# Altium schematic sheet adc ext.SchDoc
size A4
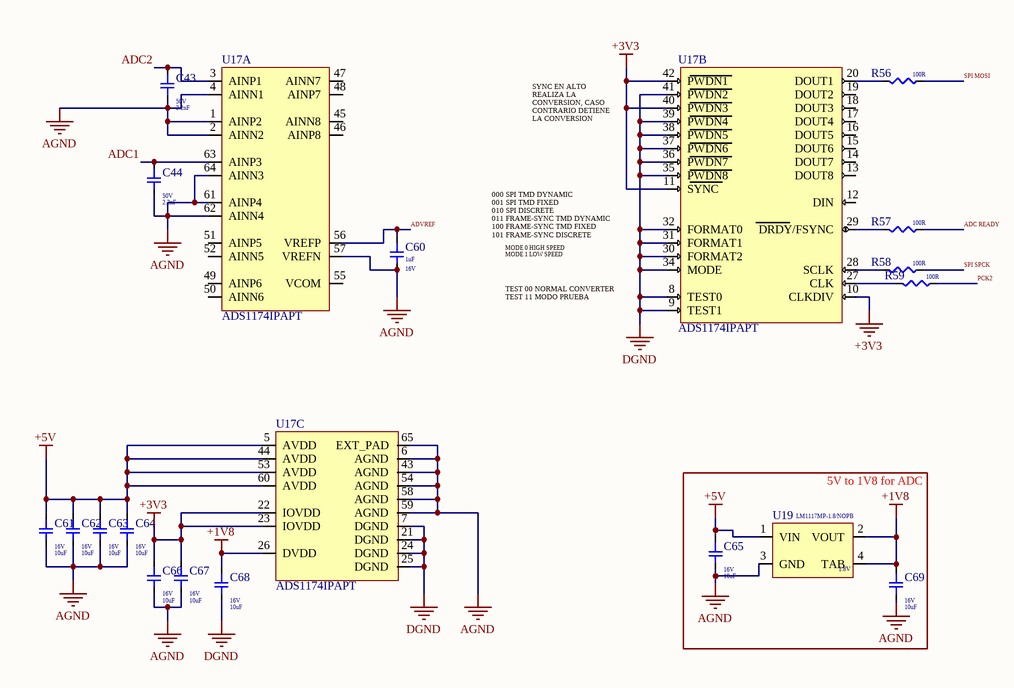
[diagram p0: adc ext.SchDoc]

## Parts
C43  Voltage: 50V  Capacitance: 2.2nF  [CAP smd 0805 OK]  (hidden comment: CAP_C0805C222K5RACTU)
C44  Voltage: 50V  Capacitance: 2.2nF  [CAP smd 0805 OK]  (hidden comment: CAP_C0805C222K5RACTU)
C60  Voltage Rating: 16V  Capacitance: 1uF  [CAP smd 0805 ok]  (hidden comment: CAP_CC0805KKX7R7BB105_YAGEO)
C61  Voltage Rating: 16V  Capacitance: 10uF  [CAP smd 0805 OK]  (hidden comment: CAP_CL21A106KOCL3RC)
C62  Voltage Rating: 16V  Capacitance: 10uF  [CAP smd 0805 OK]  (hidden comment: CAP_CL21A106KOCL3RC)
C63  Voltage Rating: 16V  Capacitance: 10uF  [CAP smd 0805 OK]  (hidden comment: CAP_CL21A106KOCL3RC)
C64  Voltage Rating: 16V  Capacitance: 10uF  [CAP smd 0805 OK]  (hidden comment: CAP_CL21A106KOCL3RC)
C65  Voltage Rating: 16V  Capacitance: 10uF  [CAP smd 0805 OK]  (hidden comment: CAP_CL21A106KOCL3RC)
C66  Voltage Rating: 16V  Capacitance: 10uF  [CAP smd 0805 OK]  (hidden comment: CAP_CL21A106KOCL3RC)
C67  Voltage Rating: 16V  Capacitance: 10uF  [CAP smd 0805 OK]  (hidden comment: CAP_CL21A106KOCL3RC)
C68  Voltage Rating: 16V  Capacitance: 10uF  [CAP smd 0805 OK]  (hidden comment: CAP_CL21A106KOCL3RC)
C69  Voltage Rating: 16V  Capacitance: 10uF  [CAP smd 0805 OK]  (hidden comment: CAP_CL21A106KOCL3RC)
R56  Resistance: 100R  [Res 1206 ok]  (hidden comment: RC1206JR-07100RL)
R57  Resistance: 100R  [Res 1206 ok]  (hidden comment: RC1206JR-07100RL)
R58  Resistance: 100R  [Res 1206 ok]  (hidden comment: RC1206JR-07100RL)
R59  Resistance: 100R  [Res 1206 ok]  (hidden comment: RC1206JR-07100RL)
U17  ADS1174IPAPT  [adc]  (parts A,B,C of 3)
U19  Max Output Voltage: 1.8V  [1V8 ALIMENTACION]  (hidden comment: LM1117MP-1.8/NOPB)

## Blocks framed on the sheet
5V to 1V8 for ADC: C65 C69 U19

## Nets
+1V8: C68.23 C69.23 U17.26(DVDD) U19.2(VOUT) U19.4(TAB)
+3V3: C66.23 C67.23 U17.10(CLKDIV) U17.11(SYNC) U17.22(IOVDD) U17.23(IOVDD) U17.40(PWDN3) U17.42(PWDN1)
+5V: C61.23 C62.23 C63.23 C64.23 C65.23 U17.5(AVDD) U17.44(AVDD) U17.53(AVDD) U17.60(AVDD) U19.1(VIN)
AGND: C43.22 C44.22 C60.22 C61.22 C62.22 C63.22 C64.22 C65.22 C66.22 C67.22 C69.22 U17.1(AINP2) U17.2(AINN2) U17.4(AINN1) U17.6(AGND) U17.43(AGND) U17.54(AGND) U17.57(VREFN) U17.58(AGND) U17.59(AGND) U17.61(AINP4) U17.62(AINN4) U17.64(AINN3) U17.65(EXT_PAD) U19.3(GND)
DGND: C68.22 U17.7(DGND) U17.8(TEST0) U17.9(TEST1) U17.21(DGND) U17.24(DGND) U17.25(DGND) U17.30(FORMAT2) U17.31(FORMAT1) U17.32(FORMAT0) U17.34(MODE) U17.35(PWDN8) U17.36(PWDN7) U17.37(PWDN6) U17.38(PWDN5) U17.39(PWDN4) U17.41(PWDN2)
ADC1: C44.23 U17.63(AINP3)
ADC2: C43.23 U17.3(AINP1)
ADC READY: R57.2
ADVREF: C60.23 U17.56(VREFP)
PCK2: R59.2
SPI MOSI: R56.2
SPI SPCK: R58.2
NetR56_1: R56.1 U17.20(DOUT1)
NetR57_1: R57.1 U17.29(DRDY/FSYNC)
NetR58_1: R58.1 U17.28(SCLK)
NetR59_1: R59.1 U17.27(CLK)

Not connected (* = marked no-connect by the designer): U17 12(DIN) 13(DOUT8) 14(DOUT7) 15(DOUT6) 16(DOUT5) 17(DOUT4) 18(DOUT3) 19(DOUT2) 45(AINN8) 46(AINP8) 47(AINN7) 48(AINP7) 49(AINP6) 50(AINN6) 51(AINP5) 52(AINN5) 55(VCOM)

## Notes on the sheet
- SYNC EN ALTO REALIZA LA CONVERSION, CASO CONTRARIO DETIENE LA CONVERSION
- MODE 0 HIGH SPEED MODE 1 LOW SPEED
- 000 SPI TMD DYNAMIC
  001 SPI TMD FIXED
  010 SPI DISCRETE
  011 FRAME-SYNC TMD DYNAMIC
  100 FRAME-SYNC TMD FIXED
  101 FRAME-SYNC DISCRETE
- TEST 00 NORMAL CONVERTER
  TEST 11 MODO PRUEBA

## Library data of the parts
C43 C44 = CAP_C0805C222K5RACTU: Cap Ceramic 0.0022uF 50V X7R 10% SMD 0805 125°C Paper T/R; Manufacturer 1: KEMET; Dissipation Factor: 2.5%; Supplier 1: Digi-Key; Manufacturer Part Number 1: C0805C222K5RACTU; Stock 1: 26149; Pricing 1: 1=0,10000, 10=0,05400, 50=0,02960, 100=0,02420, 500=0,01730, 1000=0,01360 (USD); RoHS: Yes; Mount: Surface Mount,PCB; Case/Package: 0805; Number of Pins: 2; Dielectric Material: Ceramic; Case Code (Imperial): 0805; Case Code (Metric): 2012; Min Operating Temperature: -55°C; Max Operating Temperature: 125°C; Tolerance: 10%; Packaging: Tape and Reel; Dielectric: X7R; Voltage Rating (DC): 50V; Package Quantity: 1; Series: C; Voltage Rating: 50V; Termination: SMD/SMT; Construction: Flat; Length: 2mm; Width: 0.049inch; Height: 0.78mm; Depth: 1.25mm; Lead Pitch: 0.75mm; Thickness: 0.035inch; Radiation Hardening: No; RoHS Compliant: Yes; REACH SVHC: No SVHC; ComponentLink1URL: https://datasheet.ciiva.com/28584/kem-c1002-x7r-smd-28584143.pdf?src-supplier=Element14; ComponentLink1Description: https://datasheet.ciiva.com/28584/kem-c1002-x7r-smd-28584143.pdf?src-supplier=Element14; ComponentLink2URL: https://datasheet.ciiva.com/28692/1851736-28692973.pdf?src-supplier=Element14; ComponentLink2Description: https://datasheet.ciiva.com/28692/1851736-28692973.pdf?src-supplier=Element14; Supplier Part Number 1: 399-1151-1-ND
C60 = CAP_CC0805KKX7R7BB105_YAGEO: YAGEO   CC0805KKX7R7BB105   CERAMIC CAPACITOR, 1UF, 16V, X7R, 10%, 0805; Supplier 1: Digi-Key; Manufacturer 1: Yageo; Manufacturer Part Number 1: CC0805KKX7R7BB105; Stock 1: 516899; Pricing 1: 1=0,16000, 10=0,11700, 50=0,06640, 100=0,05500, 500=0,03858, 1000=0,03194 (USD); RoHS: Yes; Mount: Surface Mount; Case/Package: 0805; Case Code (Metric): 2012; Case Code (Imperial): 0805; Min Operating Temperature: -55°C; Max Operating Temperature: 125°C; Tolerance: 10%; Dielectric: X7R; Series: CC; Packaging: Tape and Reel; Package Quantity: 1; Termination: SMD/SMT; Voltage Rating (DC): 16V; Length: 2mm; Width: 0.049inch; Depth: 1.25mm; Thickness: 0.049inch; Radiation Hardening: No; REACH SVHC: No SVHC; Lead Free: Lead Free; Halogen Free: Halogen Free; RoHS Compliant: Yes; ComponentLink1URL: https://datasheet.ciiva.com/144/mlccorderingcode-144902.pdf?src-supplier=Digi-Key; ComponentLink1Description: https://datasheet.ciiva.com/144/mlccorderingcode-144902.pdf?src-supplier=Digi-Key; ComponentLink2URL: https://datasheet.ciiva.com/144/mlccorderingcode-144903.pdf?src-supplier=Digi-Key; ComponentLink2Description: https://datasheet.ciiva.com/144/mlccorderingcode-144903.pdf?src-supplier=Digi-Key; ComponentLink3URL: https://datasheet.ciiva.com/144/mlccorderingcode-144904.pdf?src-supplier=Digi-Key; ComponentLink3Description: https://datasheet.ciiva.com/144/mlccorderingcode-144904.pdf?src-supplier=Digi-Key; ComponentLink4URL: https://datasheet.ciiva.com/11464/upy-gphc-x7r-6-3v-to-50v-8-11464750.pdf?src-supplier=Avnet; ComponentLink4Description: https://datasheet.ciiva.com/11464/upy-gphc-x7r-6-3v-to-50v-8-11464750.pdf?src-supplier=Avnet; ComponentLink5URL: https://datasheet.ciiva.com/13173/upy-gp-np0-16v-to-50v-8-3714-13173254.pdf?src-supplier=Mouser; ComponentLink5Description: https://datasheet.ciiva.com/13173/upy-gp-np0-16v-to-50v-8-3714-13173254.pdf?src-supplier=Mouser; ComponentLink6URL: https://datasheet.ciiva.com/7978/1489800-7978201.pdf?src-supplier=Element14; ComponentLink6Description: https://datasheet.ciiva.com/7978/1489800-7978201.pdf?src-supplier=Element14; ComponentLink7URL: https://datasheet.ciiva.com/28450/1489800-28450750.pdf?src-supplier=Element14; ComponentLink7Description: https://datasheet.ciiva.com/28450/1489800-28450750.pdf?src-supplier=Element14; ComponentLink8URL: https://datasheet.ciiva.com/15189/getdatasheetpartid-251802-15189206.pdf?src-supplier=Verical; ComponentLink8Description: https://datasheet.ciiva.com/15189/getdatasheetpartid-251802-15189206.pdf?src-supplier=Verical; Supplier Part Number 1: 311-1365-1-ND
C61-C69 = CAP_CL21A106KOCL3RC: CAP CER 10UF 16V X5R 0805; Manufacturer 1: Samsung; Tolerance: 10%; Supplier 1: Digi-Key; Manufacturer Part Number 1: CL21A106KOCL3RC; Stock 1: 0; RoHS: Yes; Mount: Surface Mount; Case/Package: 0805; Case Code (Metric): 2012; Case Code (Imperial): 0805; Min Operating Temperature: -55°C; Max Operating Temperature: 85°C; Package Quantity: 1; Packaging: Tape and Reel; Series: CL; Length: 0.079inch; Width: 0.049inch; Thickness: 0.037inch; RoHS Compliant: Yes; ComponentLink1URL: https://datasheet.ciiva.com/25796/cl21a106kocl3rc-25796224.pdf?src-supplier=Digi-Key; ComponentLink1Description: https://datasheet.ciiva.com/25796/cl21a106kocl3rc-25796224.pdf?src-supplier=Digi-Key; Supplier Part Number 1: 1276-2398-2-ND
R56-R59 = RC1206JR-07100RL: Thick Film Resistors SMD 1206 (3264)  100 OHM 5% 250mW; Manufacturer 1: Yageo; Temperature Coefficient: 100ppm/°C; Voltage Rating: 200V; Supplier 1: Digi-Key; Manufacturer Part Number 1: RC1206JR-07100RL; Stock 1: 1229853; Pricing 1: 1=0,10000, 10=0,06300, 100=0,02580, 1000=0,01158, 2500=0,01005 (USD); RoHS: Yes; Case/Package: 1206; Case Code (Metric): 3216; Case Code (Imperial): 1206; Size Code: 1206; Min Operating Temperature: -55°C; Max Operating Temperature: 155°C; Tolerance: 5%; Resistor Type: Thick Film; Packaging: Tape and Reel; Package Quantity: 5000; Power Rating: 250mW; Number of Terminations: 2; Termination: SMD/SMT; Max Power Dissipation: 250mW; Series: RC1206; Resistance Tolerance: 5%; Construction: Rectangular; Length: 0.122inch; Width: 0.063inch; Height: 0.026inch; Depth: 1.6mm; REACH SVHC: Unknown; Lead Free: Lead Free; Military Standard: Not; RoHS Compliant: Yes; ComponentLink1URL: https://datasheet.ciiva.com/29181/402427-da-01-en-smd-widerstand-chip1206-100-ohm-29181432.pdf?src-supplier=Conrad; ComponentLink1Description: https://datasheet.ciiva.com/29181/402427-da-01-en-smd-widerstand-chip1206-100-ohm-29181432.pdf?src-supplier=Conrad; ComponentLink2URL: https://datasheet.ciiva.com/2458/pyu-rc1206-51-rohs-l-4-2458710.pdf?src-supplier=Digi-Key; ComponentLink2Description: https://datasheet.ciiva.com/2458/pyu-rc1206-51-rohs-l-4-2458710.pdf?src-supplier=Digi-Key; ComponentLink3URL: https://datasheet.ciiva.com/2458/pyu-rc1206-51-rohs-l-4-2458711.pdf?src-supplier=Digi-Key; ComponentLink3Description: https://datasheet.ciiva.com/2458/pyu-rc1206-51-rohs-l-4-2458711.pdf?src-supplier=Digi-Key; ComponentLink4URL: https://datasheet.ciiva.com/2458/pyu-rc1206-51-rohs-l-4-2458712.pdf?src-supplier=Digi-Key; ComponentLink4Description: https://datasheet.ciiva.com/2458/pyu-rc1206-51-rohs-l-4-2458712.pdf?src-supplier=Digi-Key; ComponentLink5URL: https://datasheet.ciiva.com/16772/pyu-rc1206-51-rohs-l-4-16772235.pdf?src-supplier=Future+Electronics; ComponentLink5Description: https://datasheet.ciiva.com/16772/pyu-rc1206-51-rohs-l-4-16772235.pdf?src-supplier=Future+Electronics; Supplier Part Number 1: 311-100ERCT-ND
U17 = ADS1174IPAPT: Octal Channel Quad ADC Delta-Sigma 52ksps 16-bit Serial 64-Pin HTQFP EP T/R; Manufacturer 1: Texas Instruments; Number of Inputs: 4; Interface: SPI; Nominal Supply Current: 23mA; Max Supply Voltage: 5.25V; Min Supply Voltage: 4.75V; Max Power Dissipation: 210mW; Operating Supply Voltage: 5V; Resolution: 16b; Number of Bits: 16; Sampling Rate: 52KS/s; Signal to Noise Ratio (SNR): 97dB; Number of Analog Inputs: 8; Polarity: Bipolar; Power Dissipation: 135mW; Supply Type: Analog,Digital; Integral Nonlinearity (INL): 1LSB; Input Type: SINGLE-ENDED; Supplier 1: Digi-Key; Manufacturer Part Number 1: ADS1174IPAPT; Stock 1: 229; Pricing 1: 1=16,29000, 10=14,97100, 25=14,35040, 100=12,80650 (USD); RoHS: Yes; Mount: Surface Mount; Case/Package: HTQFP; Number of Pins: 64; Contact Plating: Gold; Min Operating Temperature: -40°C; Max Operating Temperature: 85°C; Number of Channels: 4; Package Quantity: 250; Packaging: Tape and Reel; Number of Converters: 4; Termination: SMD/SMT; Number of A/D Converters: 4; Number of Elements: 4; Conversion Rate: 52KS/s; Power Consumption: 135mW; Differential Nonlinearity: 1LSB; Supply Current: 23mA; Length: 10.2mm; Width: 10.2mm; Height: 1.05mm; REACH SVHC: No SVHC; Lead Free: Lead Free; RoHS Compliant: Yes; ComponentLink1URL: https://datasheet.ciiva.com/7226/46094-7226797.pdf?src-supplier=Newark; ComponentLink1Description: https://datasheet.ciiva.com/7226/46094-7226797.pdf?src-supplier=Newark; ComponentLink2URL: https://datasheet.ciiva.com/41461/001186699-da-01-en-ic-adc-16bit-q-ads1174ipapt-htqfp-64-tid-41461041.pdf?src-supplier=Conrad; ComponentLink2Description: https://datasheet.ciiva.com/41461/001186699-da-01-en-ic-adc-16bit-q-ads1174ipapt-htqfp-64-tid-41461041.pdf?src-supplier=Conrad; ComponentLink3URL: https://datasheet.ciiva.com/26800/ads1174ipapt-26800957.pdf?src-supplier=IIIC; ComponentLink3Description: https://datasheet.ciiva.com/26800/ads1174ipapt-26800957.pdf?src-supplier=IIIC; ComponentLink4URL: https://datasheet.ciiva.com/1704/1831206-1704289.pdf?src-supplier=Element14; ComponentLink4Description: https://datasheet.ciiva.com/1704/1831206-1704289.pdf?src-supplier=Element14; ComponentLink5URL: https://datasheet.ciiva.com/1264/ads1174-1264637.pdf?src-supplier=Digi-Key; ComponentLink5Description: https://datasheet.ciiva.com/1264/ads1174-1264637.pdf?src-supplier=Digi-Key; ComponentLink6URL: https://datasheet.ciiva.com/1264/ads1174-1264636.pdf?src-supplier=Digi-Key; ComponentLink6Description: https://datasheet.ciiva.com/1264/ads1174-1264636.pdf?src-supplier=Digi-Key; ComponentLink7URL: https://datasheet.ciiva.com/1264/ads1174-1264638.pdf?src-supplier=Digi-Key; ComponentLink7Description: https://datasheet.ciiva.com/1264/ads1174-1264638.pdf?src-supplier=Digi-Key; ComponentLink8URL: https://datasheet.ciiva.com/14257/sbas373b-14257851.pdf?src-supplier=Avnet; ComponentLink8Description: https://datasheet.ciiva.com/14257/sbas373b-14257851.pdf?src-supplier=Avnet; Supplier Part Number 1: 296-22951-1-ND
U19 = LM1117MP-1.8/NOPB: Fixed Positive LDO Regulator, 1.8V, 1.3V Dropout, BIPolar, PDSO4; Manufacturer 1: TI National Semiconductor; Number of Terminals/Pins: 4; Number of Outputs: 1; Max Input Voltage: 15V; Max Output Current: 800mA; Quiescent Current: 5mA; Accuracy: 1%; Dropout Voltage: 1.2V; Min Input Voltage: 2.6V; Current Rating: 800A; Max Supply Current: 10mA; Power Supply Rejection Ratio (PSRR): 75dB; Supplier 1: Digi-Key; Stock 1: 994; Pricing 1: 1=1,41000, 10=1,26300, 25=1,19920, 100=0,98500, 250=0,92072, 500=0,81366 (USD); RoHS: Yes; Mount: Surface Mount; Case/Package: SOT-223; Number of Pins: 4; Contact Plating: Tin,Matte; Terminal Finish: Tin; Min Operating Temperature: 0°C; Max Operating Temperature: 125°C; Output Voltage: 1.8V; Polarity: Positive; Output Type: Fixed; Output Current: 800mA; Package Quantity: 1000; Packaging: Tape and Reel; Nominal Output Voltage: 1.8V; Output Voltage Accuracy: 1%; Series: -; Output Configuration: Positive; Number of Regulators: 1; Terminal Form: SMD/SMT; Moisture Sensitivity Level: 1; Termination: SMD/SMT; Length: 6.5mm; Width: 3.56mm; Height: 1.6mm; Radiation Hardening: No; REACH SVHC: No SVHC; Lead Free: Lead Free; ComponentLink1URL: https://datasheet.ciiva.com/34302/1282062-34302143.pdf?src-supplier=Jameco; ComponentLink1Description: https://datasheet.ciiva.com/34302/1282062-34302143.pdf?src-supplier=Jameco; ComponentLink2URL: https://datasheet.ciiva.com/26904/lm1117mp-1-8-nopb-26904877.pdf?src-supplier=IIIC; ComponentLink2Description: https://datasheet.ciiva.com/26904/lm1117mp-1-8-nopb-26904877.pdf?src-supplier=IIIC; ComponentLink3URL: https://datasheet.ciiva.com/2047/lm1117-n-2047309.pdf?src-supplier=Digi-Key; ComponentLink3Description: https://datasheet.ciiva.com/2047/lm1117-n-2047309.pdf?src-supplier=Digi-Key; ComponentLink4URL: https://datasheet.ciiva.com/2047/lm1117-n-2047310.pdf?src-supplier=Digi-Key; ComponentLink4Description: https://datasheet.ciiva.com/2047/lm1117-n-2047310.pdf?src-supplier=Digi-Key; ComponentLink5URL: https://datasheet.ciiva.com/2047/lm1117-n-2047311.pdf?src-supplier=Digi-Key; ComponentLink5Description: https://datasheet.ciiva.com/2047/lm1117-n-2047311.pdf?src-supplier=Digi-Key; ComponentLink6URL: https://datasheet.ciiva.com/1570/1849796-1570200.pdf?src-supplier=Farnell; ComponentLink6Description: https://datasheet.ciiva.com/1570/1849796-1570200.pdf?src-supplier=Farnell; ComponentLink7URL: https://datasheet.ciiva.com/8042/10195-8042269.pdf?src-supplier=Element14; ComponentLink7Description: https://datasheet.ciiva.com/8042/10195-8042269.pdf?src-supplier=Element14; ComponentLink8URL: https://datasheet.ciiva.com/25980/lm1117-n-25980605.pdf?src-supplier=Avnet+Europe; ComponentLink8Description: https://datasheet.ciiva.com/25980/lm1117-n-25980605.pdf?src-supplier=Avnet+Europe; ComponentLink9URL: https://datasheet.ciiva.com/14149/lm1117-eng-tds-14149978.pdf?src-supplier=Distrelec; ComponentLink9Description: https://datasheet.ciiva.com/14149/lm1117-eng-tds-14149978.pdf?src-supplier=Distrelec; Supplier Part Number 1: LM1117MP-1.8/NOPBCT-ND; Manufacturer Part Number 1: LM1117MP-1.8/NOPB